# Altium schematic sheet dankboard-xs-ortho.SchDoc
size A4
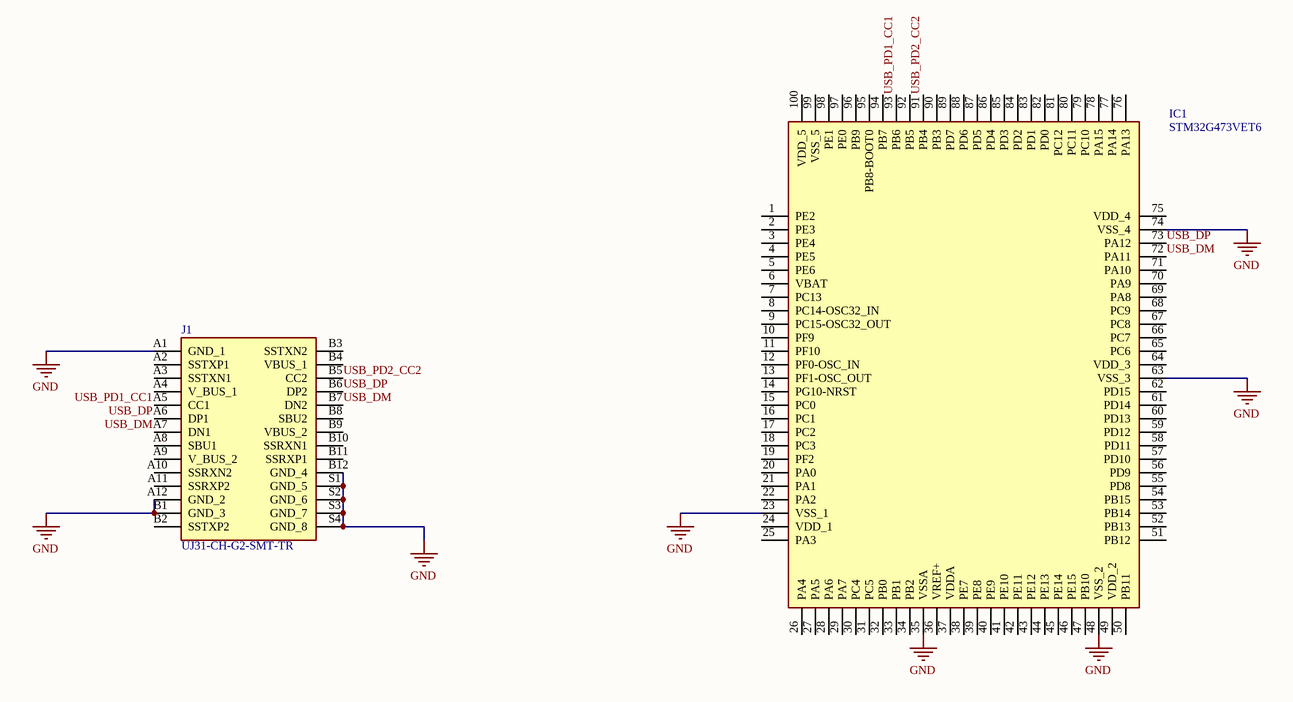
[diagram p0: dankboard-xs-ortho.SchDoc]

## Parts
IC1  STM32G473VET6  [QFP50P1600X1600X160-100N]
J1  UJ31-CH-G2-SMT-TR  [UJ31CHG2SMTTR]

## Nets
GND: IC1.23(VSS_1) IC1.35(VSSA) IC1.48(VSS_2) IC1.63(VSS_3) IC1.74(VSS_4) J1.A1(GND_1) J1.A12(GND_2) J1.B1(GND_3) J1.B12(GND_4) J1.S1(GND_5) J1.S2(GND_6) J1.S3(GND_7) J1.S4(GND_8)
USB_DM: IC1.72(PA11) J1.A7(DN1) J1.B7(DN2)
USB_DP: IC1.73(PA12) J1.A6(DP1) J1.B6(DP2)
USB_PD1_CC1: IC1.93(PB6) J1.A5(CC1)
USB_PD2_CC2: IC1.91(PB4) J1.B5(CC2)

Not connected (* = marked no-connect by the designer): IC1 1(PE2) 2(PE3) 3(PE4) 4(PE5) 5(PE6) 6(VBAT) 7(PC13) 8(PC14-OSC32_IN) 9(PC15-OSC32_OUT) 10(PF9) 11(PF10) 12(PF0-OSC_IN) 13(PF1-OSC_OUT) 14(PG10-NRST) 15(PC0) 16(PC1) 17(PC2) 18(PC3) 19(PF2) 20(PA0) 21(PA1) 22(PA2) 24(VDD_1) 25(PA3) 26(PA4) 27(PA5) 28(PA6) 29(PA7) 30(PC4) 31(PC5) 32(PB0) 33(PB1) 34(PB2) 36(VREF+) 37(VDDA) 38(PE7) 39(PE8) 40(PE9) 41(PE10) 42(PE11) 43(PE12) 44(PE13) 45(PE14) 46(PE15) 47(PB10) 49(VDD_2) 50(PB11) 51(PB12) 52(PB13) 53(PB14) 54(PB15) 55(PD8) 56(PD9) 57(PD10) 58(PD11) 59(PD12) 60(PD13) 61(PD14) 62(PD15) 64(VDD_3) 65(PC6) 66(PC7) 67(PC8) 68(PC9) 69(PA8) 70(PA9) 71(PA10) 75(VDD_4) 76(PA13) 77(PA14) 78(PA15) 79(PC10) 80(PC11) 81(PC12) 82(PD0) 83(PD1) 84(PD2) 85(PD3) 86(PD4) 87(PD5) 88(PD6) 89(PD7) 90(PB3) 92(PB5) 94(PB7) 95(PB8-BOOT0) 96(PB9) 97(PE0) 98(PE1) 99(VSS_5) 100(VDD_5); J1 A2(SSTXP1) A3(SSTXN1) A4(V_BUS_1) A8(SBU1) A9(V_BUS_2) A10(SSRXN2) A11(SSRXP2) B2(SSTXP2) B3(SSTXN2) B4(VBUS_1) B8(SBU2) B9(VBUS_2) B10(SSRXN1) B11(SSRXP1)

## Library data of the parts
IC1 = STM32G473VET6: Integrated Circuit; Manufacturer_Name: STMicroelectronics; Datasheet Link: https://www.st.com/resource/en/datasheet/stm32g473cb.pdf; Height: 1.6mm; Manufacturer_Part_Number: STM32G473VET6; Mouser Part Number: 511-STM32G473VET6; Mouser Price/Stock: https://www.mouser.co.uk/ProductDetail/STMicroelectronics/STM32G473VET6?qs=PzGy0jfpSMuOfCPr1WW9ZQ%3D%3D
J1 = UJ31-CH-G2-SMT-TR: Connector; Manufacturer_Name: CUI Devices; Datasheet Link: https://www.arrow.com/en/products/uj31-ch-g2-smt-tr/cui-devices; Height: 4.66mm; Manufacturer_Part_Number: UJ31-CH-G2-SMT-TR; Arrow Part Number: UJ31-CH-G2-SMT-TR; Arrow Price/Stock: https://www.arrow.com/en/products/uj31-ch-g2-smt-tr/cui-devices; Mouser Part Number: 490-UJ31-CH-G2SMT-TR; Mouser Price/Stock: https://www.mouser.co.uk/ProductDetail/CUI-Devices/UJ31-CH-G2-SMT-TR?qs=W0yvOO0ixfGEsh2EYrPgIQ%3D%3D